# Altium project PCB_Robo_Sumo.PrjPcb
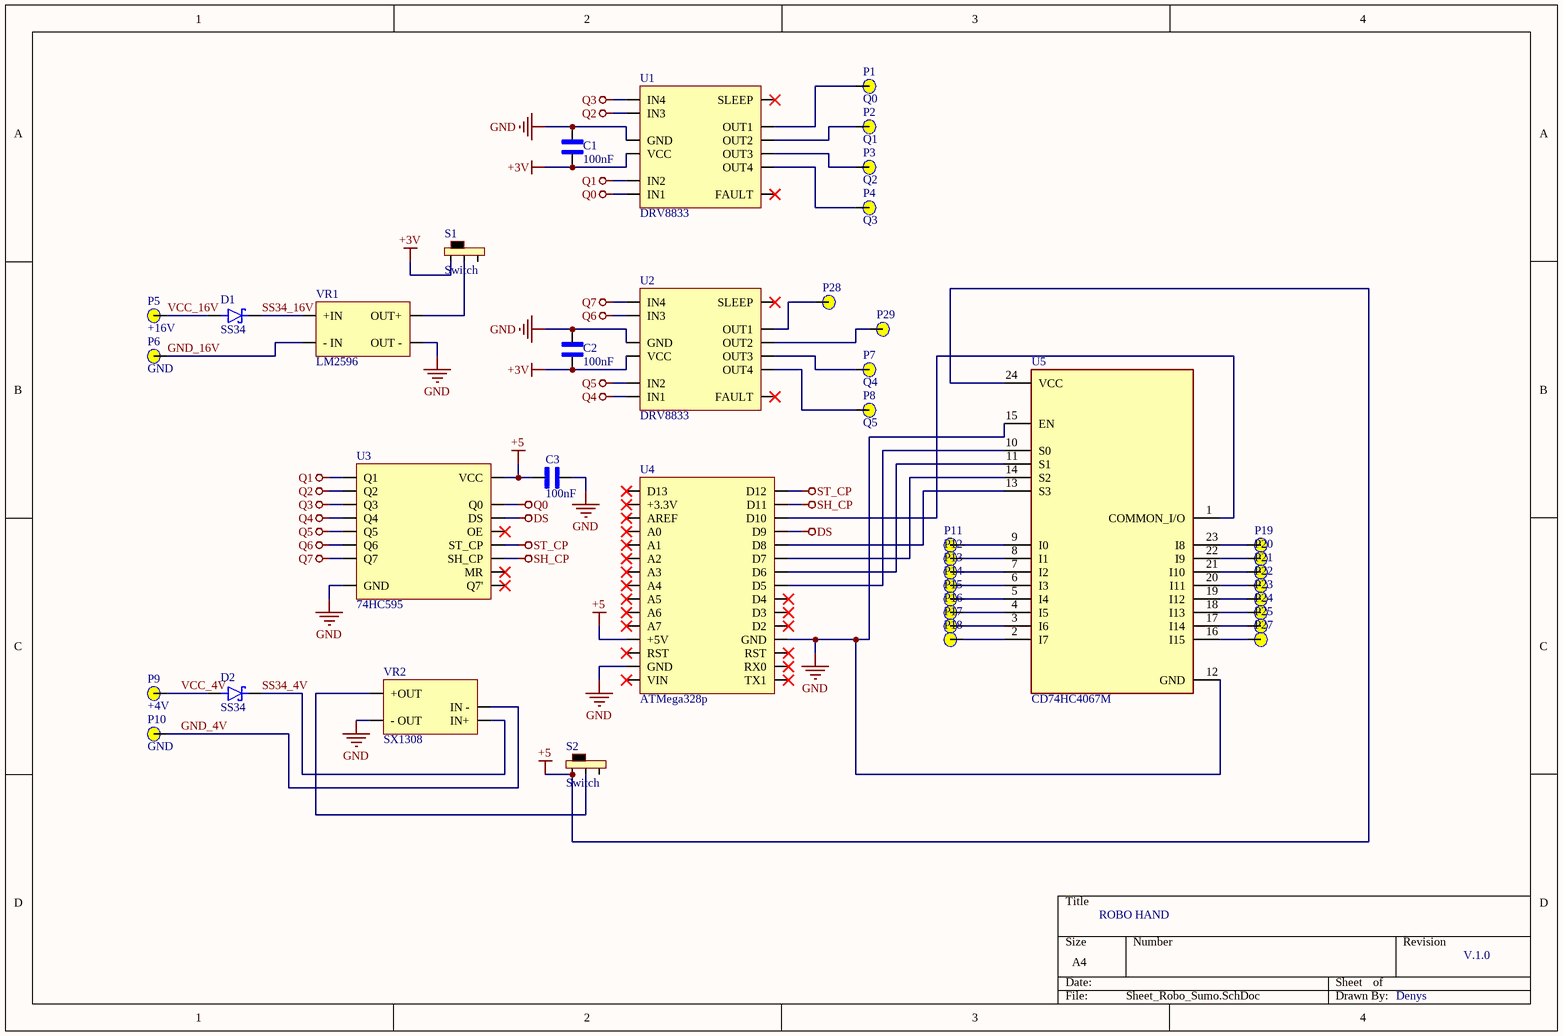
[diagram p0: Sheet_Robo_Sumo.SchDoc]
1 sheet, 42 parts. Net scope: global (net labels, ports and power ports of the same name join across sheets).
Board file: Robo_Sumo_Definitive.PcbDoc

## Sheet Sheet_Robo_Sumo.SchDoc
size A4; SheetNumber: 1; SheetTotal: 1

### Parts
C1  100nF  [CAPC3216X180N]  (no BOM)
C2  100nF  [CAPC3216X180N]  (no BOM)
C3  100nF  [CAPC3216X180N]  (no BOM)
D1  SS34  [DIOM7959X265N]  (no BOM)
D2  SS34  [DIOM7959X265N]  (no BOM)
P1  Q0  [PCB_Pin_1]  (no BOM)
P2  Q1  [PCB_Pin_1]  (no BOM)
P3  Q2  [PCB_Pin_1]  (no BOM)
P4  Q3  [PCB_Pin_1]  (no BOM)
P5  +16V  [PCB_Pin_1]  (no BOM)
P6  GND  [PCB_Pin_1]  (no BOM)
P7  Q4  [PCB_Pin_1]  (no BOM)
P8  Q5  [PCB_Pin_1]  (no BOM)
P9  +4V  [PCB_Pin_1]  (no BOM)
P10  GND  [PCB_Pin_1]  (no BOM)
P11  (no value)  [PCB_Pin_1]  (no BOM)
P12  (no value)  [PCB_Pin_1]  (no BOM)
P13  (no value)  [PCB_Pin_1]  (no BOM)
P14  (no value)  [PCB_Pin_1]  (no BOM)
P15  (no value)  [PCB_Pin_1]  (no BOM)
P16  (no value)  [PCB_Pin_1]  (no BOM)
P17  (no value)  [PCB_Pin_1]  (no BOM)
P18  (no value)  [PCB_Pin_1]  (no BOM)
P19  (no value)  [PCB_Pin_1]  (no BOM)
P20  (no value)  [PCB_Pin_1]  (no BOM)
P21  (no value)  [PCB_Pin_1]  (no BOM)
P22  (no value)  [PCB_Pin_1]  (no BOM)
P23  (no value)  [PCB_Pin_1]  (no BOM)
P24  (no value)  [PCB_Pin_1]  (no BOM)
P25  (no value)  [PCB_Pin_1]  (no BOM)
P27  (no value)  [PCB_Pin_1]  (no BOM)
P28  PIN_1  [PCB_Pin_1]  (value not drawn)  (no BOM)
P29  PIN_1  [PCB_Pin_1]  (value not drawn)  (no BOM)
S1  Switch  [Switcth]
S2  Switch  [Switcth]
U1  DRV8833  [PCB_DRV8833]  (no BOM)
U2  DRV8833  [PCB_DRV8833]  (no BOM)
U3  74HC595  [PCB_74HC595_Footprint]  (no BOM)
U4  ATMega328p  [PCB_ATMega328p]  (no BOM)
U5  CD74HC4067M  [CD74HC4067M]
VR1  LM2596  [DC-DC Step-Down Footprint]  (no BOM)
VR2  SX1308  [DC-DC Step-Up Footprint]  (no BOM)

### Nets
+3V: C1.2 C2.1 S1.0(Out1) U1.2(VCC) U2.2(VCC)
+5: C3.2 S2.0(Out1) U3.8(VCC) U4.3(+5V) U5.24(VCC)
DS: U3.10(DS) U4.18(D9)
GND: C1.1 C2.2 C3.1 U1.3(GND) U2.3(GND) U3.0(GND) U4.1(GND) U4.26(GND) U5.12(GND) U5.15(EN) VR1.3(OUT_-) VR2.0(-_OUT)
Q0: U1.0(IN1) U3.9(Q0)
Q1: U1.1(IN2) U3.7(Q1)
Q2: U1.4(IN3) U3.6(Q2)
Q3: U1.5(IN4) U3.5(Q3)
Q4: U2.0(IN1) U3.4(Q4)
Q5: U2.1(IN2) U3.3(Q5)
Q6: U2.4(IN3) U3.2(Q6)
Q7: U2.5(IN4) U3.1(Q7)
SH_CP: U3.13(SH_CP) U4.16(D11)
ST_CP: U3.12(ST_CP) U4.15(D12)
GND_4V: P10.0(Pin) VR2.2(IN_-)
GND_16V: P6.0(Pin) VR1.0(-_IN)
SS34_4V: D2.C(K) VR2.3(IN+)
SS34_16V: D1.C(K) VR1.1(+IN)
VCC_4V: D2.A P9.0(Pin)
VCC_16V: D1.A P5.0(Pin)
NetP1_0: P1.0(Pin) U1.7(OUT1)
NetP2_0: P2.0(Pin) U1.8(OUT2)
NetP3_0: P3.0(Pin) U1.9(OUT3)
NetP4_0: P4.0(Pin) U1.10(OUT4)
NetP7_0: P7.0(Pin) U2.9(OUT3)
NetP8_0: P8.0(Pin) U2.10(OUT4)
NetP11_0: P11.0(Pin) U5.9(I0)
NetP12_0: P12.0(Pin) U5.8(I1)
NetP13_0: P13.0(Pin) U5.7(I2)
NetP14_0: P14.0(Pin) U5.6(I3)
NetP15_0: P15.0(Pin) U5.5(I4)
NetP16_0: P16.0(Pin) U5.4(I5)
NetP17_0: P17.0(Pin) U5.3(I6)
NetP18_0: P18.0(Pin) U5.2(I7)
NetP19_0: P19.0(Pin) U5.23(I8)
NetP20_0: P20.0(Pin) U5.22(I9)
NetP21_0: P21.0(Pin) U5.21(I10)
NetP22_0: P22.0(Pin) U5.20(I11)
NetP23_0: P23.0(Pin) U5.19(I12)
NetP24_0: P24.0(Pin) U5.18(I13)
NetP25_0: P25.0(Pin) U5.17(I14)
NetP27_0: P27.0(Pin) U5.16(I15)
NetP28_0: P28.0(Pin) U2.7(OUT1)
NetP29_0: P29.0(Pin) U2.8(OUT2)
NetS1_1: S1.1(In) VR1.2(OUT+)
NetS2_1: S2.1(In) VR2.1(+OUT)
NetU4_17: U4.17(D10) U5.1(COMMON_I/O)
NetU4_19: U4.19(D8) U5.13(S3)
NetU4_20: U4.20(D7) U5.14(S2)
NetU4_21: U4.21(D6) U5.11(S1)
NetU4_22: U4.22(D5) U5.10(S0)

Not connected (* = marked no-connect by the designer): S1 2(Out2); S2 2(Out2); U1 6(SLEEP)* 11(FAULT)*; U2 6(SLEEP)* 11(FAULT)*; U3 11(OE)* 14(MR)* 15(Q7')*; U4 0(VIN)* 2(RST)* 4(A7)* 5(A6)* 6(A5)* 7(A4)* 8(A3)* 9(A2)* 10(A1)* 11(A0)* 12(AREF)* 13(+3.3V)* 14(D13)* 23(D4)* 24(D3)* 25(D2)* 27(RST)* 28(RX0)* 29(TX1)*

### Notes on the sheet
- ROBO HAND
- V.1.0
- Denys

### Library data of the parts
C1-C3 = C_1206_100nF: Ceramic capacitor SMD 1206 100 nF 50 V 10 % Samsung Electro-Mechanics CL31B104KBCNNNC 4000 pc(s); MP: CL31B104KBCNNNC; SnapEDA_Link: https://www.snapeda.com/parts/CL31B104KBCNNNC/Samsung+Electro-Mechanics/view-part/?ref=snap; Availability: In Stock; MF: Samsung Electro-Mechanics; Package: 1206 Samsung; Check_prices: https://www.snapeda.com/parts/CL31B104KBCNNNC/Samsung+Electro-Mechanics/view-part/?ref=eda; Value: *; Purchase-URL: https://pricing.snapeda.com/search/part/CL31B104KBCNNNC/?ref=eda; Price: None
D1 D2 = Diode_SS34: SS34 - діод Шоттки; MF: onsemi; SnapEDA_Link: https://www.snapeda.com/parts/SS34/Onsemi/view-part/?ref=snap; Package: SMC-2 ON Semiconductor; Value: *; MP: SS34; Check_prices: https://www.snapeda.com/parts/SS34/Onsemi/view-part/?ref=eda
P1-P25 P27 = PIN_1
U1 U2 = Motor Driver: Драйвер крокового/колекторних двигунів DRV8833
U3 = SCS-16: SN74HC595N - вихідний зсувний регістр 74HC595
U4 = Arduino Nano: DCCduino Nano CH340 - аналог Arduino Nano v3.0 TYPE C
U5 = CD74HC4067M: 5-V, 16:1, 1-channel analog multiplexer; Value: *; Availability: Unavailable; Package: None; MP: CD74HC4067M; Price: None
VR1 = DC-DC Step-Down: DC-DC конвертер знижуючий 4.5...40В на 1.5...35В на LM2596
VR2 = DC-DC Step-Up: Mini DC-DC конвертер підвищує 2.5..10В 5В/8В/9В/12В на SX1308